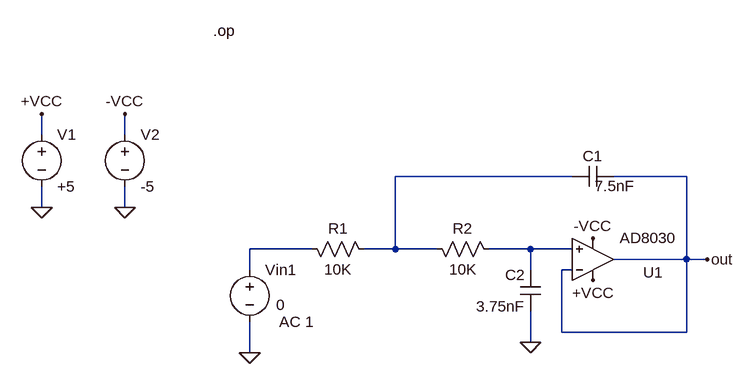
[diagram p0: schematic FTJ_DCOP.asc]
FTJ_DCOP.asc, the LTspice schematic file:
Version 4.1
SHEET 1 1224 680
WIRE 128 0 128 -32
WIRE 256 0 256 -32
WIRE 944 64 672 64
WIRE 1120 64 1008 64
WIRE 128 112 128 80
WIRE 256 112 256 80
WIRE 544 176 448 176
WIRE 672 176 672 64
WIRE 672 176 624 176
WIRE 736 176 672 176
WIRE 880 176 816 176
WIRE 944 176 880 176
WIRE 1120 192 1120 64
WIRE 1120 192 1008 192
WIRE 1152 192 1120 192
WIRE 448 208 448 176
WIRE 880 208 880 176
WIRE 944 208 928 208
WIRE 928 304 928 208
WIRE 1120 304 1120 192
WIRE 1120 304 928 304
WIRE 880 320 880 272
WIRE 448 336 448 288
FLAG 880 320 0
FLAG 1152 192 out
FLAG 128 112 0
FLAG 256 112 0
FLAG 256 -32 -VCC
FLAG 976 160 -VCC
FLAG 128 -32 +VCC
FLAG 976 224 +VCC
FLAG 448 336 0
DATAFLAG 496 176 ""
DATAFLAG 1120 192 ""
SYMBOL OpAmps\\AD8030 976 256 M180
WINDOW 0 77 44 Left 2
WINDOW 3 41 97 Left 2
SYMATTR InstName U1
SYMBOL res 528 160 M90
WINDOW 0 0 56 VBottom 2
WINDOW 3 32 56 VTop 2
SYMATTR InstName R1
SYMATTR Value 10K
SYMBOL res 720 160 M90
WINDOW 0 0 56 VBottom 2
WINDOW 3 32 56 VTop 2
SYMATTR InstName R2
SYMATTR Value 10K
SYMBOL cap 1008 48 R90
WINDOW 0 0 32 VBottom 2
WINDOW 3 15 -2 VTop 2
SYMATTR InstName C1
SYMATTR Value 7.5nF
SYMBOL cap 896 272 R180
WINDOW 0 24 56 Left 2
WINDOW 3 24 8 Left 2
SYMATTR InstName C2
SYMATTR Value 3.75nF
SYMBOL voltage 128 -16 R0
WINDOW 123 0 0 Left 0
WINDOW 39 0 0 Left 0
SYMATTR InstName V1
SYMATTR Value +5
SYMBOL voltage 256 -16 R0
WINDOW 123 0 0 Left 0
WINDOW 39 0 0 Left 0
SYMATTR InstName V2
SYMATTR Value -5
SYMBOL voltage 448 192 R0
WINDOW 3 41 70 Left 2
WINDOW 123 45 96 Left 2
WINDOW 39 0 0 Left 0
SYMATTR Value 0
SYMATTR Value2 AC 1
SYMATTR InstName Vin1
TEXT 392 -160 Left 2 !.op

The netlist it stands for:
* FTJ_DCOP.asc
X§U1 N003 out +VCC -VCC out AD8040  ; AD8030, pins In+ In- V+ V- OUT
R1 N002 N001 10K
R2 N001 N003 10K
C1 out N001 7.5nF
C2 0 N003 3.75nF
V1 +VCC 0 +5
V2 -VCC 0 -5
Vin1 N002 0 0 AC 1
.op
.lib ADI.lib
.backanno
.end